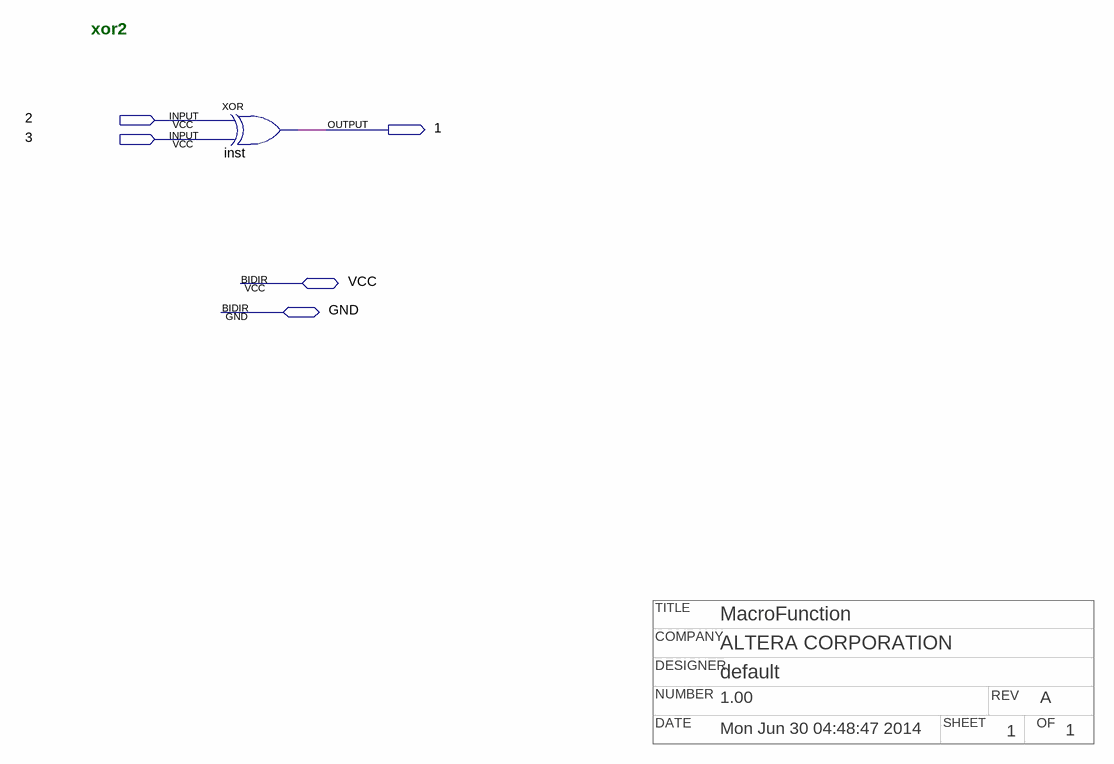
[diagram p0: schematic sheet]
// Quartus schematic npxor2.bdf as structural Verilog: 1 symbols, 5 pins
// Title block: TITLE: MacroFunction; COMPANY: ALTERA CORPORATION; DESIGNER: default; NUMBER: 1.00; REV: A; DATE: Mon Jun 30 04:48:47 2014; SHEET: 1; OF: 1
module npxor2 (
  input  \2 ,
  input  \3 ,
  inout  VCC,
  inout  GND,
  output \1 
);

  xor inst (\1 , \2 , \3 );

  // Notes on the sheet:
  //   xor2
endmodule
